# EAGLE design Scheda_analogica (EAGLE 6.5.0)
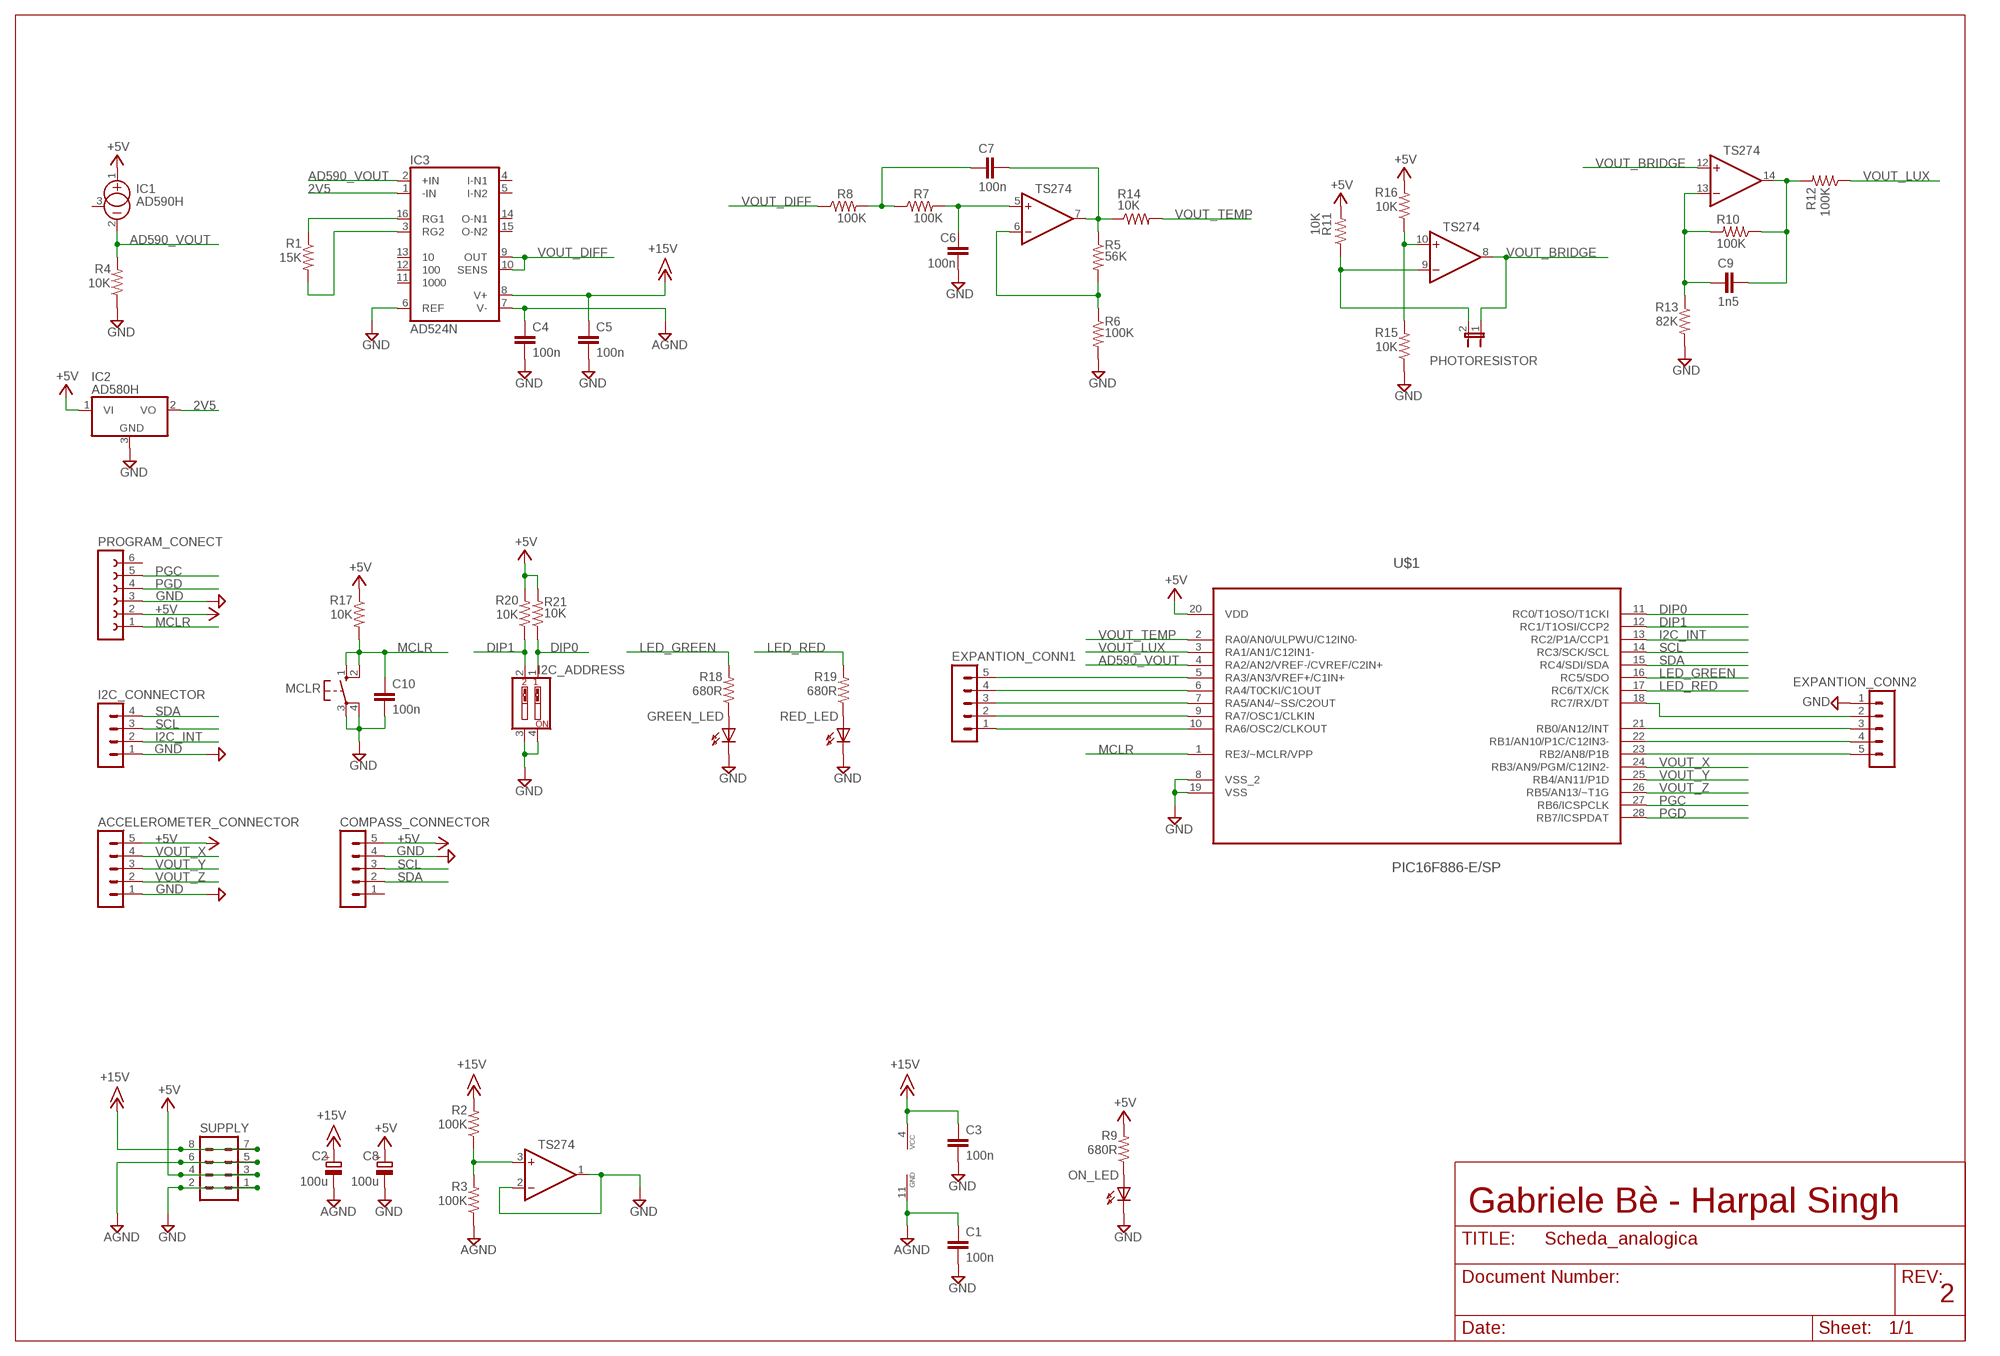
[diagram p0: schematic, sheet 1]

## Parts
ACCELEROMETER_CONNECTOR  MA05-1  [MA05-1]
C1  100n  C-EU050-024X044  [C050-024X044]
C2  100u  CPOL-EUE2.5-7  [E2,5-7]
C3  100n  C-EU050-024X044  [C050-024X044]
C4  100n  C-EU050-024X044  [C050-024X044]
C5  100n  C-EU050-024X044  [C050-024X044]
C6  100n  C-EU050-024X044  [C050-024X044]
C7  100n  C-EU050-024X044  [C050-024X044]
C8  100u  CPOL-EUE2.5-7  [E2,5-7]
C9  1n5  C-EU050-024X044  [C050-024X044]
C10  100n  C-EU050-024X044  [C050-024X044]
COMPASS_CONNECTOR  MA05-1  [MA05-1]
EXPANTION_CONN1  MA05-1  [MA05-1]
EXPANTION_CONN2  MA05-1  [MA05-1]
GREEN_LED  HLMP6  [HLMP6]
I2C_ADDRESS  SW_DIP-2  [EDG-02]
I2C_CONNECTOR  MA04-1  [MA04-1]
IC1  AD590H  [TO18]
IC2  AD580H  [TO39]
IC3  AD524N  [DIL16]
IC4  TS274  [DIL14]
MCLR  10-XX  [B3F-10XX]
ON_LED  HLMP6  [HLMP6]
PHOTORESISTOR  JP1E  [JP1]
PROGRAM_CONECT  FE06-1  [FE06]
R1  15K  R-US_0207/10  [0207/10]
R2  100K  R-US_0207/10  [0207/10]
R3  100K  R-US_0207/10  [0207/10]
R4  10K  R-US_0207/10  [0207/10]
R5  56K  R-US_0207/10  [0207/10]
R6  100K  R-US_0207/10  [0207/10]
R7  100K  R-US_0207/10  [0207/10]
R8  100K  R-US_0207/10  [0207/10]
R9  680R  R-US_0207/10  [0207/10]
R10  100K  R-US_0207/10  [0207/10]
R11  10K  R-US_0207/10  [0207/10]
R12  100K  R-US_0207/10  [0207/10]
R13  82K  R-US_0207/10  [0207/10]
R14  10K  R-US_0207/10  [0207/10]
R15  10K  R-US_0207/10  [0207/10]
R16  10K  R-US_0207/10  [0207/10]
R17  10K  R-US_0207/10  [0207/10]
R18  680R  R-US_0207/10  [0207/10]
R19  680R  R-US_0207/10  [0207/10]
R20  10K  R-US_0207/10  [0207/10]
R21  10K  R-US_0207/10  [0207/10]
RED_LED  HLMP6  [HLMP6]
SUPPLY  MA04-2  [MA04-2]
U$1  PIC16F886-E/SP  [DIP254P762X508-28]

## Nets
2V5: IC2.2(VO) IC3.1(-IN)
+5V: ACCELEROMETER_CONNECTOR.5 C8.+ COMPASS_CONNECTOR.5 IC1.1(+) IC2.1(VI) PROGRAM_CONECT.2 R9.2 R11.2 R16.2 R17.1 R20.2 R21.2 SUPPLY.3 SUPPLY.4 U$1.20(VDD)
+15V: C2.+ C3.1 C5.1 IC3.8(V+) IC4.4(VCC) R2.2 SUPPLY.7 SUPPLY.8
AD590_VOUT: IC1.2(-) IC3.2(+IN) R4.2 U$1.4(RA2/AN2/VREF-/CVREF/C2IN+)
AGND: C1.1 C2.- C4.1 IC3.7(V-) IC4.11(GND) R3.1 SUPPLY.5 SUPPLY.6
DIP0: I2C_ADDRESS.1 R21.1 U$1.11(RC0/T1OSO/T1CKI)
DIP1: I2C_ADDRESS.2 R20.1 U$1.12(RC1/T1OSI/CCP2)
GND: ACCELEROMETER_CONNECTOR.1 C1.2 C3.2 C4.2 C5.2 C6.2 C8.- C10.2 COMPASS_CONNECTOR.4 EXPANTION_CONN2.1 GREEN_LED.K I2C_ADDRESS.3 I2C_ADDRESS.4 I2C_CONNECTOR.1 IC2.3(GND) IC3.6(REF) IC4.1(OUT) IC4.2(-IN) MCLR.3(P) MCLR.4(P1) ON_LED.K PROGRAM_CONECT.3 R4.1 R6.2 R13.2 R15.1 RED_LED.K SUPPLY.1 SUPPLY.2 U$1.8(VSS_2) U$1.19(VSS)
I2C_INT: I2C_CONNECTOR.2 U$1.13(RC2/P1A/CCP1)
LED_GREEN: R18.2 U$1.16(RC5/SDO)
LED_RED: R19.2 U$1.17(RC6/TX/CK)
MCLR: C10.1 MCLR.1(S) MCLR.2(S1) PROGRAM_CONECT.1 R17.2 U$1.1(RE3/~MCLR/VPP)
N$1: IC3.16(RG1) R1.1
N$2: IC3.3(RG2) R1.2
N$3: IC4.6(-IN) R5.2 R6.1
N$4: ON_LED.A R9.1
N$5: IC4.3(+IN) R2.1 R3.2
N$6: C6.1 IC4.5(+IN) R7.2
N$7: C7.1 R7.1 R8.2
N$8: C7.2 IC4.7(OUT) R5.1 R14.1
N$9: IC4.9(-IN) PHOTORESISTOR.2 R11.1
N$10: GREEN_LED.A R18.1
N$11: IC4.10(+IN) R15.2 R16.1
N$12: C9.1 IC4.13(-IN) R10.2 R13.1
N$13: C9.2 IC4.14(OUT) R10.1 R12.2
N$14: R19.1 RED_LED.A
N$15: EXPANTION_CONN1.1 U$1.10(RA6/OSC2/CLKOUT)
N$16: EXPANTION_CONN1.2 U$1.9(RA7/OSC1/CLKIN)
N$17: EXPANTION_CONN1.3 U$1.7(RA5/AN4/~SS/C2OUT)
N$18: EXPANTION_CONN1.4 U$1.6(RA4/T0CKI/C1OUT)
N$19: EXPANTION_CONN1.5 U$1.5(RA3/AN3/VREF+/C1IN+)
N$20: EXPANTION_CONN2.2 U$1.18(RC7/RX/DT)
N$21: EXPANTION_CONN2.3 U$1.21(RB0/AN12/INT)
N$22: EXPANTION_CONN2.4 U$1.22(RB1/AN10/P1C/C12IN3-)
N$23: EXPANTION_CONN2.5 U$1.23(RB2/AN8/P1B)
PGC: PROGRAM_CONECT.5 U$1.27(RB6/ICSPCLK)
PGD: PROGRAM_CONECT.4 U$1.28(RB7/ICSPDAT)
SCL: COMPASS_CONNECTOR.3 I2C_CONNECTOR.3 U$1.14(RC3/SCK/SCL)
SDA: COMPASS_CONNECTOR.2 I2C_CONNECTOR.4 U$1.15(RC4/SDI/SDA)
VOUT_BRIDGE: IC4.8(OUT) IC4.12(+IN) PHOTORESISTOR.1
VOUT_DIFF: IC3.9(OUT) IC3.10(SENS) R8.1
VOUT_LUX: R12.1 U$1.3(RA1/AN1/C12IN1-)
VOUT_TEMP: R14.2 U$1.2(RA0/AN0/ULPWU/C12IN0-)
VOUT_X: ACCELEROMETER_CONNECTOR.4 U$1.24(RB3/AN9/PGM/C12IN2-)
VOUT_Y: ACCELEROMETER_CONNECTOR.3 U$1.25(RB4/AN11/P1D)
VOUT_Z: ACCELEROMETER_CONNECTOR.2 U$1.26(RB5/AN13/~T1G)
Unconnected: COMPASS_CONNECTOR.1 IC1.3(CAN) IC3.4(I-N1) IC3.5(I-N2) IC3.11 IC3.12 IC3.13 IC3.14(O-N1) IC3.15(O-N2) PROGRAM_CONECT.6

## Notes on the sheet
- Gabriele Bè - Harpal Singh
- 2

## Library data of the parts
ACCELEROMETER_CONNECTOR COMPASS_CONNECTOR EXPANTION_CONN1 EXPANTION_CONN2 = con-lstb:MA05-1: PIN HEADER; OC_FARNELL: unknown; OC_NEWARK: unknown
C1 C3-C7 C9 C10 = rcl:C-EU: CAPACITOR, European symbol
C2 C8 = rcl:CPOL-EU: POLARIZED CAPACITOR, European symbol
GREEN_LED ON_LED RED_LED = display-hp:HLMP6: LED 2mm horizontal; MF: AGILENT TECHNOLOGIES; MPN: HLMP-6500; OC_FARNELL: 1652490; OC_NEWARK: 40K0088
I2C_ADDRESS = special:SW_DIP-2: DIP SWITCH
I2C_CONNECTOR = con-lstb:MA04-1: PIN HEADER; OC_FARNELL: unknown; OC_NEWARK: unknown
IC1 = linear:AD590H: TEMPERATURE SENSOR current output
IC2 = linear:AD580H: VOLTAGE REFERENCE 2.5 V
IC3 = linear:AD524: OP AMP
IC4 = ITIS_v2:TS274
MCLR = ITIS:10-XX: OMRON SWITCH
PHOTORESISTOR = jumper:JP1E: JUMPER
PROGRAM_CONECT = con-lsta:FE06-1: FEMALE HEADER; OC_FARNELL: unknown; OC_NEWARK: unknown
R1-R21 = rcl:R-US_: RESISTOR, American symbol
SUPPLY = con-lstb:MA04-2: PIN HEADER; OC_FARNELL: unknown; OC_NEWARK: unknown
U$1 = Microchip_By_element14_Batch_1:PIC16F886-E/SP: 8-Bit CMOS Microcontrollers; MPN: PIC16F886-E/SP; OC_FARNELL: 1579590; OC_NEWARK: 74K8573; PACKAGE: DIP-28; SUPPLIER: Microchip

## Board
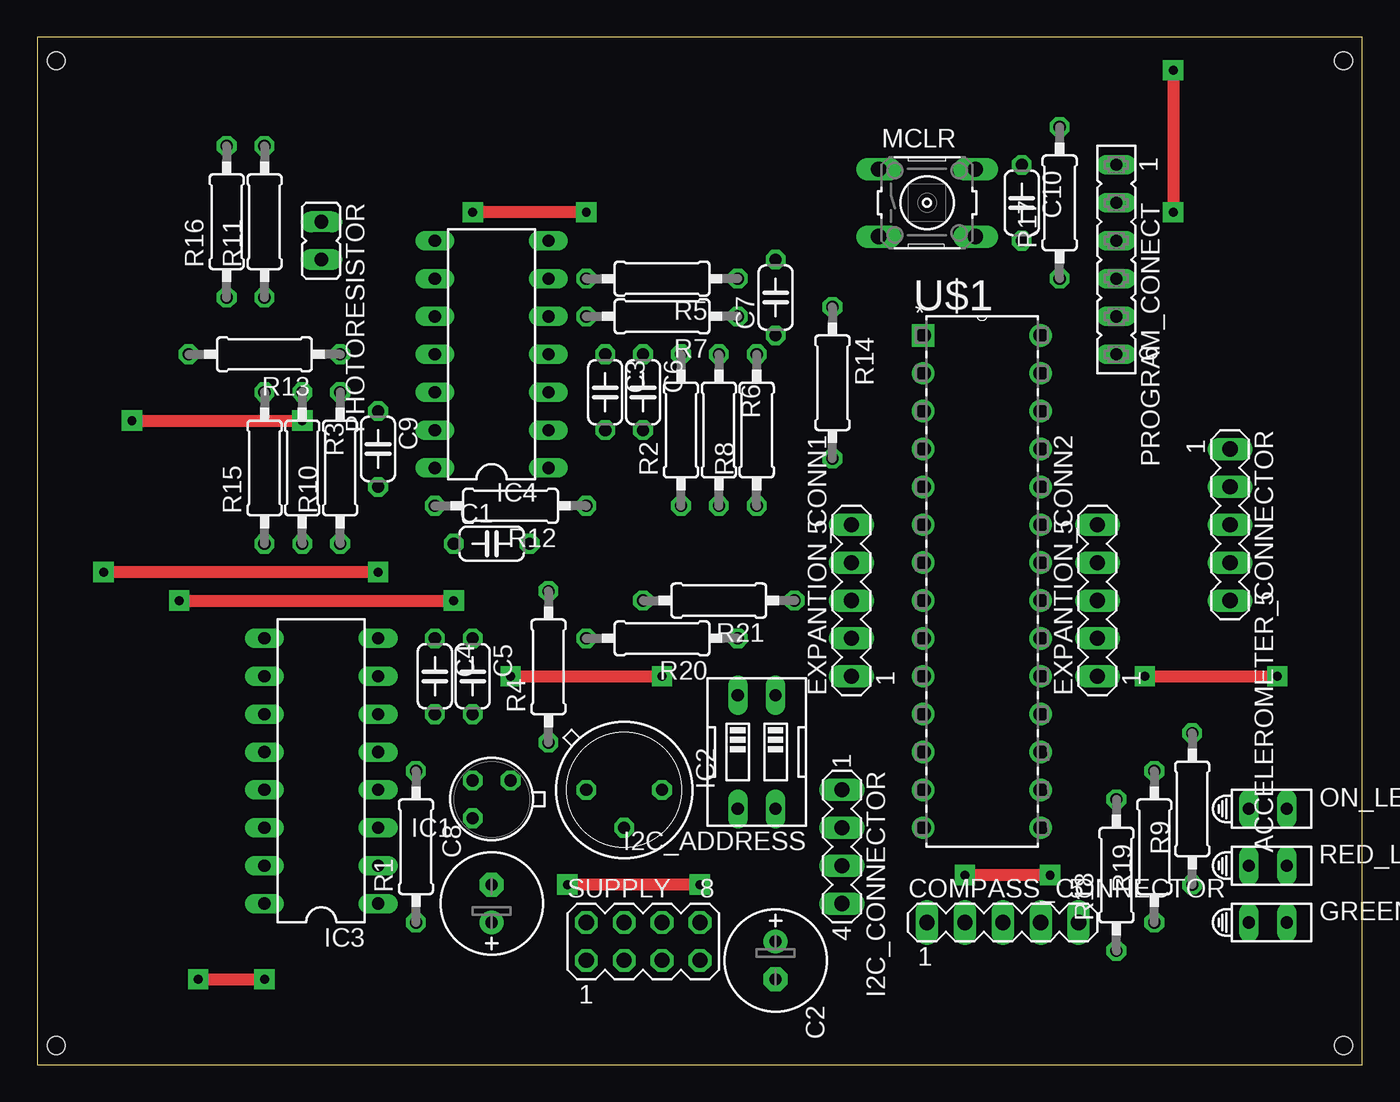
[diagram p1: board, top side]
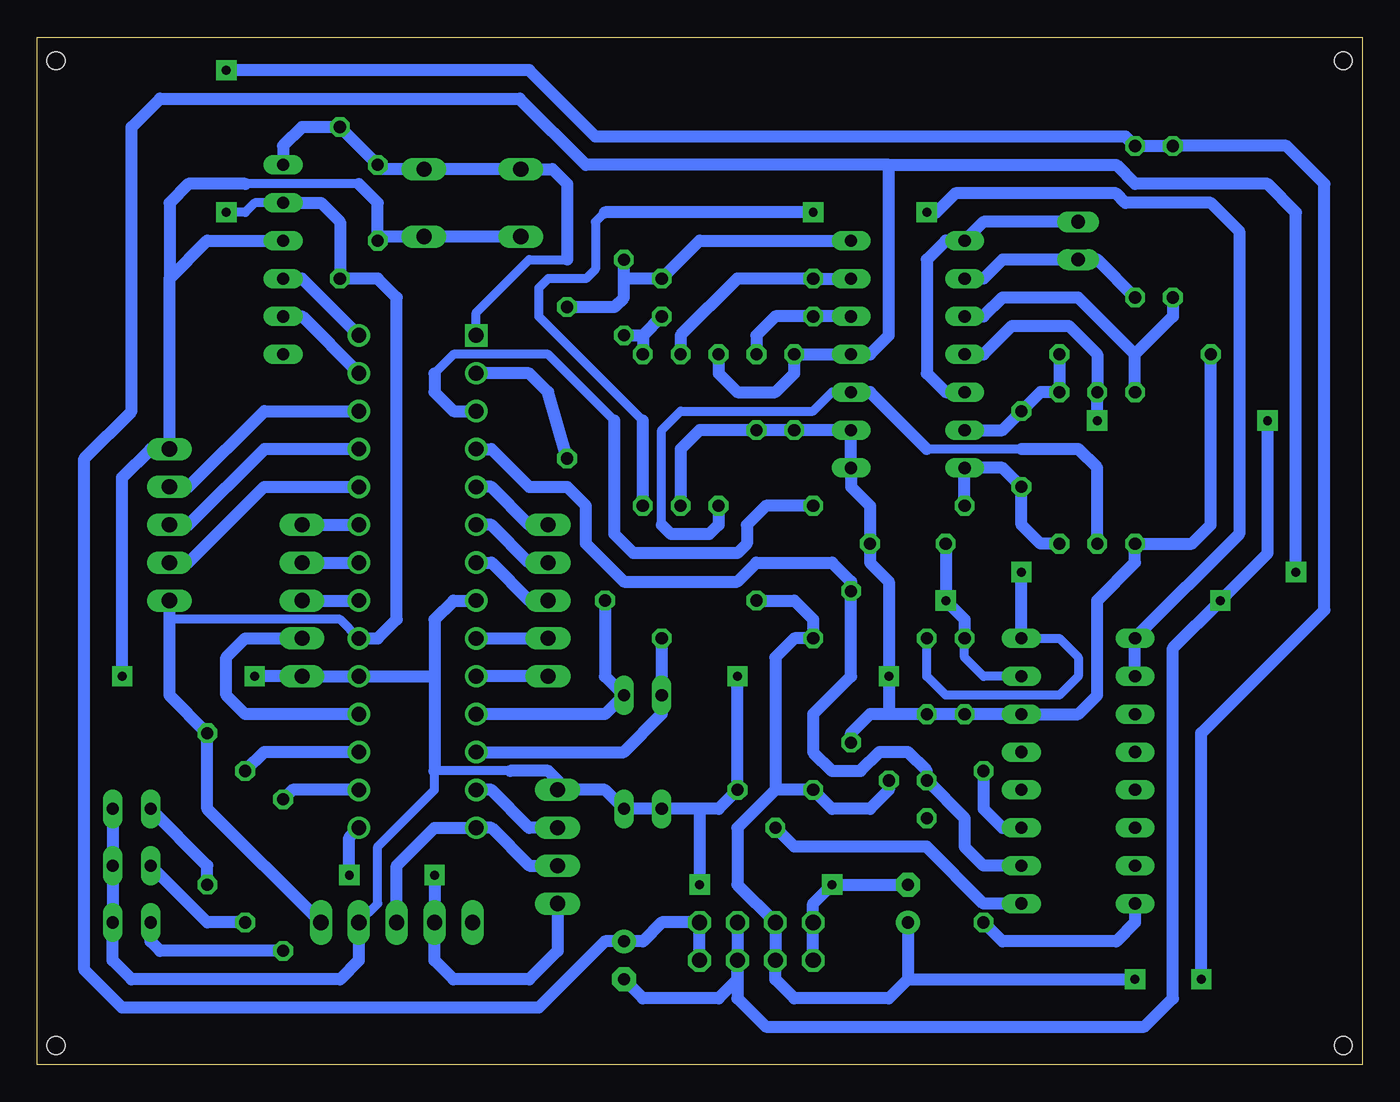
[diagram p2: board, bottom side, seen from below]

Size 88.88 x 68.88 mm. Coordinates in mm from the lower left corner, seen from the top.
Outline: 0,0 88.88,0 88.88,68.88 0,68.88 0,0
Copper layers (1*16): Top 0.035mm / dielectric 1.5mm / Bottom 0.035mm
Design rules "default *": minimum track width 10mil, minimum drill 24mil, track to track 8mil, track to pad 8mil, pad to pad 8mil, via to via 8mil, smd to smd 8mil, copper to edge 40mil, drill to drill 8mil, minimum pad ring 10mil, minimum via ring 15mil, stop-mask expansion 4mil, vias tented up to drill 0mil, thermal gap 10mil
Holes 1.2 mm at 1.27,1.27 1.27,67.31 87.63,67.31 87.63,1.27

### Footprints (pad centres in the part's own frame; a part is rotated, then mirrored left to right if it is on the bottom)
MA05-1 = drill 1.016 long: 1 -5.08,0; 2 -2.54,0; 3 0,0; 4 2.54,0; 5 5.08,0
C050-024X044 = drill 0.813 octagon: 1 -2.54,0; 2 2.54,0
E2,5-7 = drill 0.813 pad 1.6: + -1.27,0 | drill 0.813 pad 1.6 octagon: - 1.27,0
HLMP6 = drill 0.813 long: A -1.27,0; K 1.27,0
EDG-02 = drill 0.813 long: 1 -1.27,-3.81; 2 1.27,-3.81; 3 1.27,3.81; 4 -1.27,3.81
MA04-1 = drill 1.016 long: 1 -3.81,0; 2 -1.27,0; 3 1.27,0; 4 3.81,0
TO18 = drill 0.813 octagon: 1 -1.27,-1.27; 2 1.27,-1.27; 3 1.27,1.27
TO39 = drill 0.813 octagon: 1 0,-2.54; 2 2.54,0; 3 0,2.54
DIL16 = drill 0.813 long: 1 -8.89,-3.81; 2 -6.35,-3.81; 3 -3.81,-3.81; 4 -1.27,-3.81; 5 1.27,-3.81; 6 3.81,-3.81; 7 6.35,-3.81; 8 8.89,-3.81; 9 8.89,3.81; 10 6.35,3.81; 11 3.81,3.81; 12 1.27,3.81; 13 -1.27,3.81; 14 -3.81,3.81; 15 -6.35,3.81; 16 -8.89,3.81
DIL14 = drill 0.813 long: 1 -7.62,-3.81; 2 -5.08,-3.81; 3 -2.54,-3.81; 4 0,-3.81; 5 2.54,-3.81; 6 5.08,-3.81; 7 7.62,-3.81; 8 7.62,3.81; 9 5.08,3.81; 10 2.54,3.81; 11 0,3.81; 12 -2.54,3.81; 13 -5.08,3.81; 14 -7.62,3.81
B3F-10XX = drill 1.016 long: 1 -3.251,2.261; 2 3.251,2.261; 3 -3.251,-2.261; 4 3.251,-2.261
JP1 = drill 0.914 long: 1 0,-1.27; 2 0,1.27
FE06 = drill 0.813 long: 1 -6.35,0; 2 -3.81,0; 3 -1.27,0; 4 1.27,0; 5 3.81,0; 6 6.35,0
0207/10 = drill 0.813 octagon: 1 -5.08,0; 2 5.08,0
MA04-2 = drill 1.016 octagon: 1 -3.81,-1.27; 2 -3.81,1.27; 3 -1.27,-1.27; 4 -1.27,1.27; 5 1.27,-1.27; 6 1.27,1.27; 7 3.81,-1.27; 8 3.81,1.27
DIP254P762X508-28 = drill 0.991 square: 1 -7.874,33.02 | drill 0.991: 2 -7.874,30.48; 3 -7.874,27.94; 4 -7.874,25.4; 5 -7.874,22.86; 6 -7.874,20.32; 7 -7.874,17.78; 8 -7.874,15.24; 9 -7.874,12.7; 10 -7.874,10.16; 11 -7.874,7.62; 12 -7.874,5.08; 13 -7.874,2.54; 14 -7.874,0; 15 0,0; 16 0,2.54; 17 0,5.08; 18 0,7.62; 19 0,10.16; 20 0,12.7; 21 0,15.24; 22 0,17.78; 23 0,20.32; 24 0,22.86; 25 0,25.4; 26 0,27.94; 27 0,30.48; 28 0,33.02

### Placement (x,y rotation side)
ACCELEROMETER_CONNECTOR  80.01,36.2 270 top
C1  30.48,34.92 0 top
C2  49.53,6.99 270 top
C3  38.1,45.08 270 top
C4  26.67,26.04 270 top
C5  29.21,26.04 270 top
C6  40.64,45.08 270 top
C7  49.53,51.44 90 top
C8  30.48,10.8 90 top
C9  22.86,41.28 270 top
C10  66.04,57.78 270 top
COMPASS_CONNECTOR  64.77,9.53 0 top
EXPANTION_CONN1  54.61,31.11 90 top
EXPANTION_CONN2  71.12,31.11 90 top
GREEN_LED  82.55,9.53 0 top
I2C_ADDRESS  48.26,20.96 180 top
I2C_CONNECTOR  53.98,14.61 270 top
IC1  30.48,17.78 180 top
IC2  39.37,18.42 270 top
IC3  19.05,19.68 90 top
IC4  30.48,47.62 90 top
MCLR  59.69,57.78 0 top
ON_LED  82.55,17.14 0 top
PHOTORESISTOR  19.05,55.25 180 top
PROGRAM_CONECT  72.39,53.97 270 top
R1  25.4,14.61 90 top
R2  43.18,42.55 90 top
R3  17.78,40 270 top
R4  34.29,26.67 90 top
R5  41.91,52.7 180 top
R6  45.72,42.55 270 top
R7  41.91,50.16 180 top
R8  48.26,42.55 90 top
R9  77.47,17.14 90 top
R10  20.32,40 90 top
R11  15.24,56.52 90 top
R12  31.75,37.47 180 top
R13  15.24,47.62 180 top
R14  53.34,45.72 270 top
R15  15.24,40 90 top
R16  12.7,56.52 90 top
R17  68.58,57.78 90 top
R18  72.39,12.7 90 top
R19  74.93,14.61 90 top
R20  41.91,28.57 180 top
R21  45.72,31.11 180 top
RED_LED  82.55,13.34 0 top
SUPPLY  40.64,8.26 0 top
U$1  67.31,15.88 0 top

### Tracks (layer width: path | path; a pad name or v marks a point on that pad's centre or on a via)
2V5
  Bottom 0.813: IC3.1 25.4,10.8 29.21,14.61 38.1,14.61 IC2.2
+5V  (via drill 0.6)
  Top 0.813: v76.2,66.67 v76.2,57.15 | v10.8,5.71 v15.24,5.71
  Bottom 0.61: U$1.20 68.58,29.85 80.01,29.85 | PROGRAM_CONECT.2 74.3,57.78 74.93,57.15 v76.2,57.15
  Bottom 0.813: PROGRAM_CONECT.2 69.85,57.78 68.58,56.52 R17.1 66.04,52.7 64.77,51.44 64.77,29.85 66.04,28.57 U$1.20 | ACCELEROMETER_CONNECTOR.5 80.01,29.85 80.01,24.77 R9.2 77.47,17.14 COMPASS_CONNECTOR.5 | v76.2,66.67 55.88,66.67 51.44,62.23 15.88,62.23 R11.2 R16.2 5.08,61.59 2.54,59.05 2.54,30.48 10.8,22.22 v10.8,5.71 | 39.37,18.42 IC2.1 35.56,17.14 33.02,17.14 31.75,18.42 IC1.1 | R21.2 38.1,31.11 36.83,29.85 R20.2 38.1,28.57 39.37,27.31 39.37,18.42 | 39.37,18.42 41.91,15.88 41.91,12.07 SUPPLY.4 SUPPLY.3 39.37,5.71 38.1,4.45 31.75,4.45 30.48,5.71 | C8.+ 30.48,5.71 | 30.48,5.71 v15.24,5.71
+15V  (via drill 0.6)
  Top 0.813: v22.86,33.02 v4.45,33.02
  Bottom 0.61: IC3.8 20.32,28.57 19.05,27.31 19.05,26.04 20.32,24.77 27.94,24.77 29.21,26.04 C5.1
  Bottom 0.813: SUPPLY.7 SUPPLY.8 46.99,9.53 48.26,8.26 C2.+ 50.8,8.26 55.25,3.81 83.19,3.81 85.73,6.35 85.73,40.64 82.55,43.81 82.55,62.86 80.64,64.77 56.52,64.77 52.07,60.33 31.75,60.33 | R2.2 43.18,46.36 41.91,45.08 39.37,45.08 38.1,46.36 C3.1 IC4.4 33.02,47.62 31.75,48.89 31.75,60.33 | 31.75,60.33 16.51,60.33 15.24,59.05 6.35,59.05 4.45,57.15 v4.45,33.02 | IC3.8 v22.86,33.02
AD590_VOUT
  Bottom 0.813: IC3.2 25.4,13.34 26.67,14.61 26.67,16.51 IC1.2 29.21,19.68 30.48,20.96 32.39,20.96 33.66,19.68 35.56,19.68 36.83,20.96 36.83,23.5 34.29,26.04 R4.2 34.29,32.39 35.56,33.66 40.64,33.66 41.91,32.39 49.53,32.39 52.07,34.92 52.07,37.47 53.34,38.73 55.88,38.73 58.42,41.28 U$1.4
AGND  (via drill 0.6)
  Top 0.813: v6.35,43.18 v17.78,43.18 | v9.52,31.11 v27.94,31.11
  Bottom 0.61: IC3.7 25.4,26.04 26.67,27.31 C4.1
  Bottom 0.813: SUPPLY.5 41.91,5.71 43.18,4.45 48.26,4.45 C2.- | C1.1 v27.94,31.11 26.67,29.85 C4.1 | IC4.11 25.4,47.62 23.5,49.53 19.69,49.53 17.78,47.62 R3.1 v17.78,43.18 | SUPPLY.6 SUPPLY.5 | SUPPLY.5 41.91,4.45 40,2.54 14.61,2.54 12.7,4.45 12.7,27.94 v9.52,31.11 6.35,34.29 v6.35,43.18
DIP0
  Bottom 0.813: R21.1 50.8,26.04 I2C_ADDRESS.1 50.8,23.5 U$1.11
DIP1
  Bottom 0.813: R20.1 I2C_ADDRESS.2 46.99,23.5 49.53,20.96 U$1.12
GND  (via drill 0.6)
  Top 0.813: v74.3,26.04 v83.19,26.04 | v31.75,26.04 v41.91,26.04 | v44.45,12.07 v35.56,12.07
  Bottom 0.61: 67.31,59.05 74.93,59.05 | 57.15,19.68 62.23,19.68 62.23,18.42 66.04,14.61 66.04,10.8 COMPASS_CONNECTOR.4
  Bottom 0.813: 80.01,52.7 ACCELEROMETER_CONNECTOR.1 81.28,41.28 83.19,39.37 v83.19,26.04 | 80.01,52.7 77.47,55.25 PROGRAM_CONECT.3 | ON_LED.K RED_LED.K GREEN_LED.K 83.82,6.99 82.55,5.71 68.58,5.71 67.31,6.99 COMPASS_CONNECTOR.4 | SUPPLY.1 SUPPLY.2 36.83,10.8 v35.56,12.07 C8.- | MCLR.3 MCLR.4 65.76,55.52 C10.2 66.04,57.78 67.31,59.05 | R13.2 10.16,36.2 11.43,34.92 R15.1 15.24,33.66 17.78,31.11 17.78,24.77 19.05,23.5 IC3.6 C4.2 C5.2 31.75,23.5 | R6.2 45.72,41.28 44.45,42.55 C6.2 C3.2 IC4.2 IC4.1 34.29,38.73 33.02,37.47 C1.2 33.02,33.66 31.75,32.39 v31.75,26.04 31.75,23.5 | 44.45,17.14 I2C_ADDRESS.3 I2C_ADDRESS.4 50.8,18.42 I2C_CONNECTOR.1 53.98,19.05 54.61,19.68 57.15,19.68 | v74.3,26.04 EXPANTION_CONN2.1 U$1.19 62.23,26.04 | 74.93,59.05 78.74,59.05 80.01,57.78 80.01,52.7 | 31.75,23.5 33.02,23.5 34.29,22.22 R4.1 | U$1.8 60.96,31.11 62.23,29.85 62.23,26.04 | 62.23,26.04 62.23,19.68 | v41.91,26.04 IC2.3 43.18,17.14 44.45,17.14 | 44.45,17.14 v44.45,12.07
I2C_INT
  Bottom 0.813: I2C_CONNECTOR.2 55.88,15.88 58.42,18.42 U$1.13
LED_GREEN
  Bottom 0.813: U$1.16 71.75,18.42 R18.2
LED_RED
  Bottom 0.813: U$1.17 73.66,20.96 R19.2
MCLR
  Bottom 0.61: U$1.1 59.44,50.42 55.88,53.97 53.34,53.97
  Bottom 0.813: PROGRAM_CONECT.1 72.39,61.59 71.12,62.86 R17.2 C10.1 65.76,60.05 MCLR.2 MCLR.1 54.33,60.05 53.34,59.05 53.34,53.97
N$1
  Bottom 0.813: IC3.16 15.24,9.53 16.51,8.26 24.13,8.26 R1.1
N$2
  Bottom 0.813: R1.2 25.4,17.14 24.13,15.88 IC3.3
N$3
  Bottom 0.813: IC4.6 R5.2 41.91,52.7 45.72,48.89 R6.1
N$4
  Bottom 0.813: R9.1 77.47,13.34 ON_LED.A
N$5
  Bottom 0.61: 22.86,41.28 29.21,41.28 | IC4.3 35.56,45.08 36.83,43.81 45.72,43.81 46.99,42.55 46.99,36.2
  Bottom 0.813: R3.2 17.78,40 19.05,41.28 22.86,41.28 | R2.1 43.18,36.2 43.81,35.56 46.36,35.56 46.99,36.2 | IC4.3 33.02,45.08 29.21,41.28
N$6
  Bottom 0.813: IC4.5 R7.2 39.37,50.16 40.64,48.89 C6.1
N$7
  Bottom 0.813: R7.1 48.26,48.89 | 48.26,48.89 R8.2 | C7.1 48.26,48.89
N$8
  Bottom 0.813: R14.1 50.17,50.8 49.53,51.44 49.53,52.7 | 49.53,52.7 C7.2 | 49.53,52.7 R5.1 44.45,55.25 IC4.7
N$9
  Bottom 0.813: IC4.9 25.4,52.7 24.13,53.97 PHOTORESISTOR.2 17.78,53.97 R11.1
N$10
  Bottom 0.813: R18.1 80.64,7.62 81.28,8.26 GREEN_LED.A
N$11
  Bottom 0.813: R15.2 15.24,47.62 | 15.24,47.62 19.05,51.44 24.13,51.44 25.4,50.16 IC4.10 | R16.1 12.7,50.16 15.24,47.62
N$12
  Bottom 0.813: R13.1 R10.2 21.59,45.08 C9.1 24.13,42.55 IC4.13
N$13
  Bottom 0.813: R10.1 21.59,34.92 22.86,36.2 C9.2 24.13,40 IC4.14 R12.2
N$14
  Bottom 0.813: R19.1 77.47,9.53 RED_LED.A
N$15
  Bottom 0.813: 59.44,26.29 U$1.10 EXPANTION_CONN1.1
N$16
  Bottom 0.813: U$1.9 EXPANTION_CONN1.2
N$17
  Bottom 0.813: U$1.7 58.42,33.66 55.88,31.11 EXPANTION_CONN1.3
N$18
  Bottom 0.813: EXPANTION_CONN1.4 55.88,33.66 58.42,36.2 U$1.6
N$19
  Bottom 0.813: EXPANTION_CONN1.5 55.88,36.2 58.42,38.73 U$1.5
N$20
  Bottom 0.813: EXPANTION_CONN2.2 74.93,28.57 76.2,27.31 76.2,24.77 74.93,23.5 U$1.18
N$21
  Bottom 0.813: EXPANTION_CONN2.3 U$1.21
N$22
  Bottom 0.813: EXPANTION_CONN2.4 U$1.22
N$23
  Bottom 0.813: EXPANTION_CONN2.5 U$1.23
N$25  (via drill 0.6)
  other vias: 29.21,57.15
N$27  (via drill 0.6)
  other vias: 4.45,33.02
PGC
  Bottom 0.813: PROGRAM_CONECT.5 71.12,50.16 U$1.27
PGD
  Bottom 0.813: PROGRAM_CONECT.4 71.12,52.7 U$1.28
SCL
  Bottom 0.813: I2C_CONNECTOR.3 55.88,13.34 58.42,15.88 U$1.14 62.23,15.88 64.77,13.34 COMPASS_CONNECTOR.3
SDA  (via drill 0.6)
  Top 0.813: v67.95,12.7 v62.23,12.7
  Bottom 0.813: I2C_CONNECTOR.4 53.98,7.62 55.88,5.71 60.96,5.71 62.23,6.99 COMPASS_CONNECTOR.2 v62.23,12.7 | v67.95,12.7 67.95,15.24 U$1.15
VOUT_BRIDGE
  Bottom 0.813: IC4.12 27.94,45.08 29.21,46.36 29.21,53.97 27.94,55.25 IC4.8 25.4,56.52 PHOTORESISTOR.1
VOUT_DIFF  (via drill 0.6)
  Top 0.813: v36.83,57.15 v29.21,57.15
  Bottom 0.61: 48.26,43.18 55.25,50.16 55.25,52.07 54.61,52.7 52.07,52.7 51.44,53.34 51.44,56.52 50.8,57.15
  Bottom 0.813: IC3.10 IC3.9 8.26,35.56 8.26,55.88 10.16,57.78 15.88,57.78 16.51,58.42 27.31,58.42 28.58,57.15 v29.21,57.15 | R8.1 48.26,43.18 | v36.83,57.15 50.8,57.15
VOUT_LUX
  Bottom 0.61: 62.23,46.36 60.96,47.62 54.61,47.62 50.17,43.18
  Bottom 0.813: R12.1 40,37.47 41.28,36.2 41.28,34.92 41.91,34.29 48.89,34.29 50.17,35.56 50.17,43.18 | 62.23,46.36 62.23,45.08 60.96,43.81 U$1.3
VOUT_TEMP
  Bottom 0.813: R14.2 54.61,45.08 55.88,46.36 U$1.2
VOUT_X
  Bottom 0.813: U$1.24 73.66,38.73 78.74,33.66 ACCELEROMETER_CONNECTOR.4
VOUT_Y
  Bottom 0.813: U$1.25 73.66,41.28 78.74,36.2 ACCELEROMETER_CONNECTOR.3
VOUT_Z
  Bottom 0.813: ACCELEROMETER_CONNECTOR.2 78.74,38.73 73.66,43.81 U$1.26